# Altium schematic sheet CAN-Test-Board.SchDoc
size C
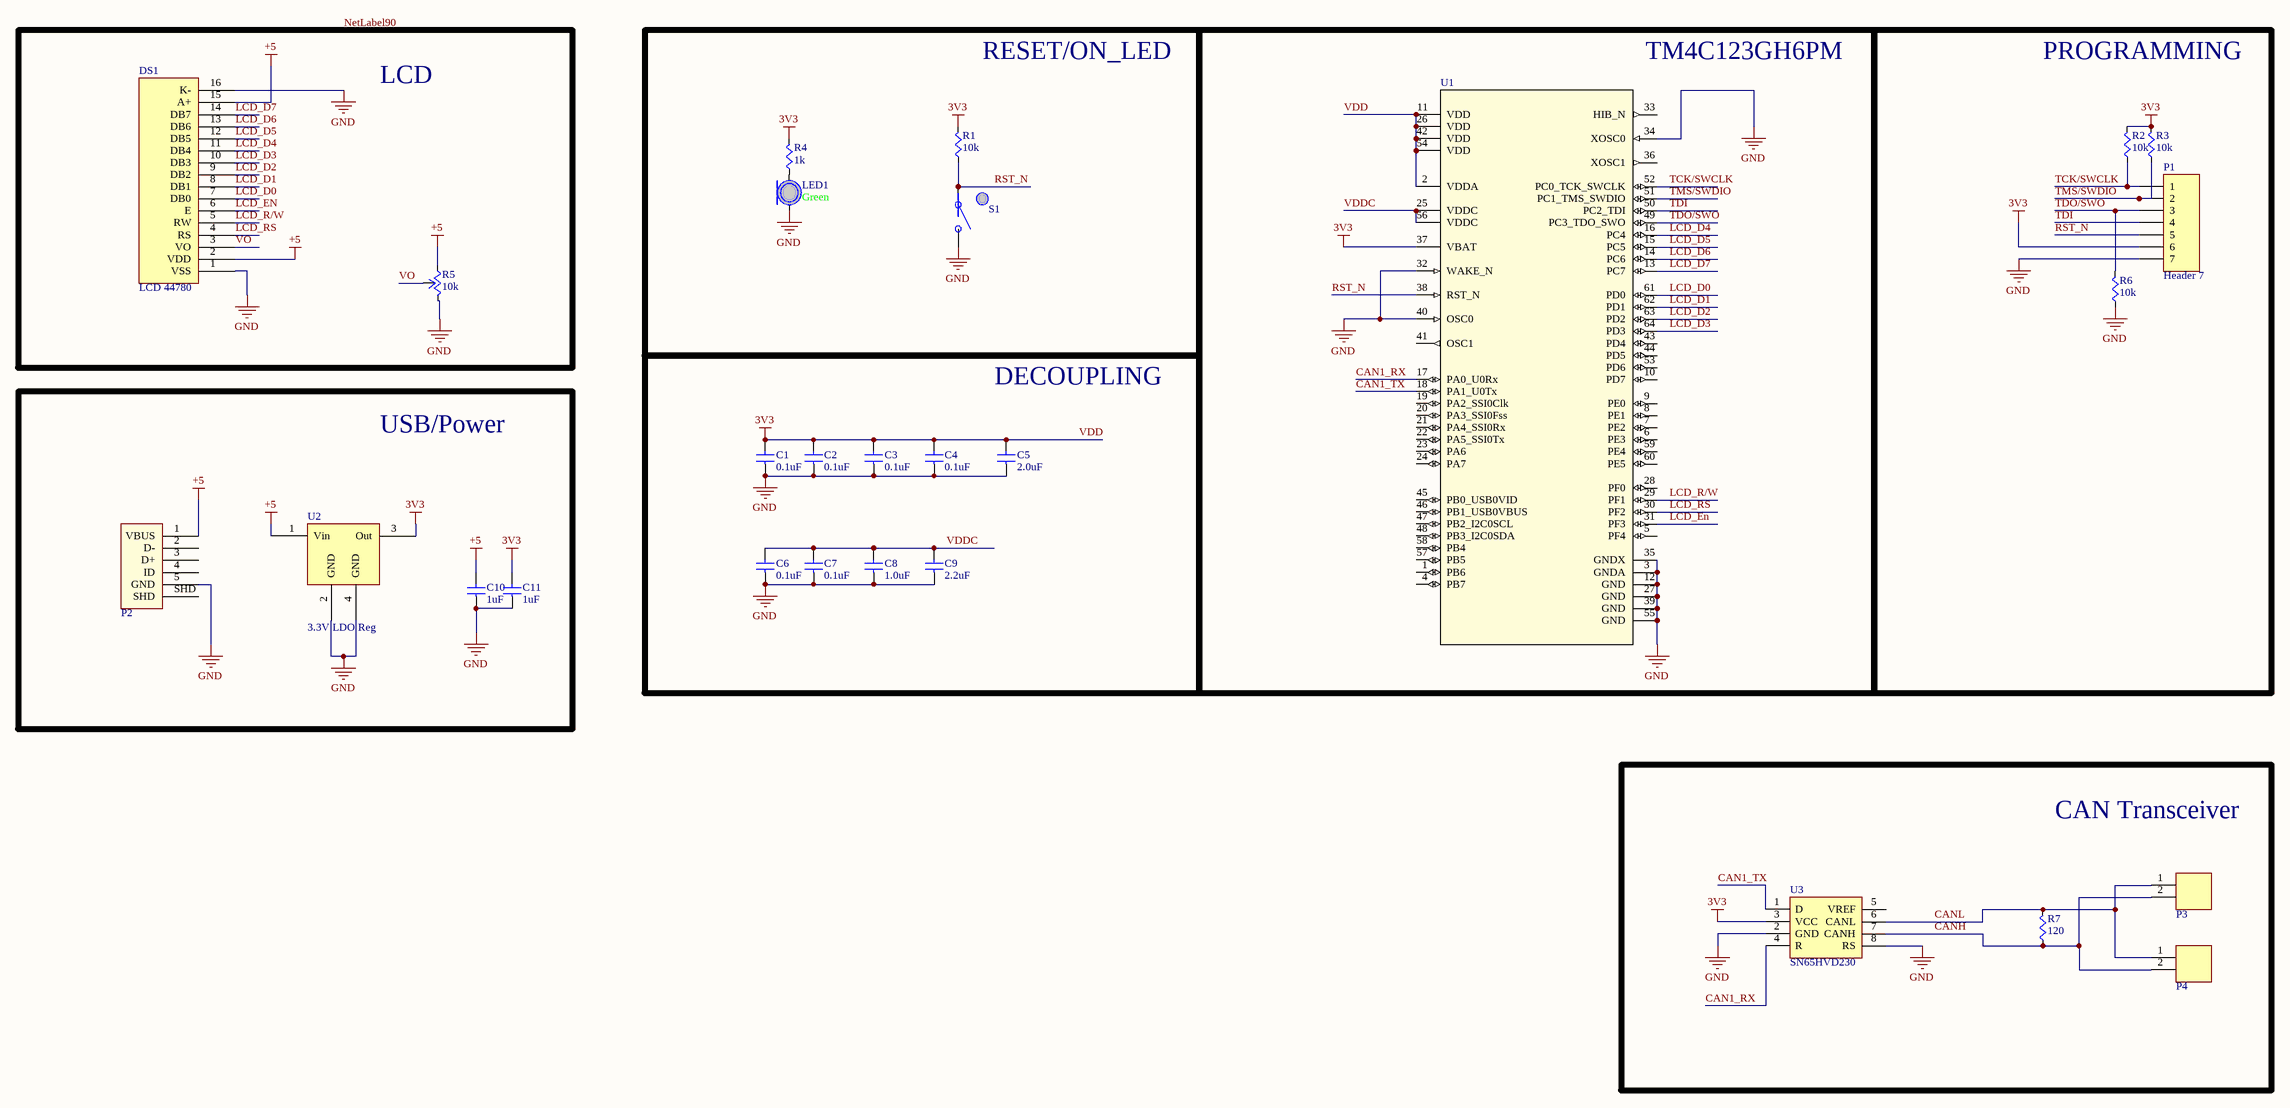
[diagram p0: CAN-Test-Board.SchDoc]

## Parts
C1  value 0.1uF  [CAPC0603]  (hidden comment: Cap)
C2  value 0.1uF  [CAPC0603]  (hidden comment: Cap)
C3  value 0.1uF  [CAPC0603]  (hidden comment: Cap)
C4  value 0.1uF  [CAPC0603]  (hidden comment: Cap)
C5  value 2.0uF  [CAPC0603]  (hidden comment: Cap)
C6  value 0.1uF  [CAPC0603]  (hidden comment: Cap)
C7  value 0.1uF  [CAPC0603]  (hidden comment: Cap)
C8  value 1.0uF  [CAPC0603]  (hidden comment: Cap)
C9  value 2.2uF  [CAPC0603]  (hidden comment: Cap)
C10  value 1uF  [CAPC0603]  (hidden comment: Cap)
C11  value 1uF  [CAPC0603]  (hidden comment: Cap)
DS1  LCD 44780  [OLED 16x2]
LED1  Color: Green  [LED0603]  (hidden comment: LED)
P1  Header 7  [HDR1X7]
P2  USB Micro  [10118192-0001LF]  (value not drawn)
P3  2-pin Horz Sherlock  [MOLEX-HDR-1X2-SHERLOCK-HORZ]  (value not drawn)
P4  2-pin Horz Sherlock  [MOLEX-HDR-1X2-SHERLOCK-HORZ]  (value not drawn)
R1  value 10k  [RES0603]  (hidden comment: Res)
R2  value 10k  [RES0603]  (hidden comment: Res)
R3  value 10k  [RES0603]  (hidden comment: Res)
R4  value 1k  [RES0603]  (hidden comment: Res)
R5  value 10k  [ST4ETA103]  (hidden comment: Pot)
R6  value 10k  [RES0603]  (hidden comment: Res)
R7  value 120  [RES0603]  (hidden comment: Res)
S1  Button  [PTS645xxxxSMTR92]  (value not drawn)
U1  (no value)  [PM0064A_N]
U2  3.3V LDO Reg  [SOT23-4n]
U3  SN65HVD230

## Blocks framed on the sheet
LCD: DS1 R5
RESET/ON_LED: LED1 R1 R4 S1
TM4C123GH6PM: U1
PROGRAMMING: P1 R2 R3 R6
USB/Power: C10 C11 P2 U2
DECOUPLING: C1-C9
CAN Transceiver: P3 P4 R7 U3

## Nets
+5: C10.1(A) DS1.2(VDD) DS1.15(A+) P2.1(VBUS) R5.2 U2.1(Vin)
GND: C1.2(B) C2.2(B) C3.2(B) C4.2(B) C5.2(B) C6.2(B) C7.2(B) C8.2(B) C9.2(B) C10.2(B) C11.2(B) DS1.1(VSS) DS1.16(K-) LED1.C P1.7 P2.5(GND) R5.1 R6.2(B) S1.B U1.3(GNDA) U1.12(GND) U1.27(GND) U1.32(WAKE_N) U1.34(XOSC0) U1.35(GNDX) U1.39(GND) U1.40(OSC0) U1.55(GND) U2.2(GND) U2.4(GND) U3.2(GND) U3.8(RS)
VDD: C1.1(A) C2.1(A) C3.1(A) C4.1(A) C5.1(A) C11.1(A) P1.6 R1.1(A) R2.1(A) R3.1(A) R4.1(A) U1.2(VDDA) U1.11(VDD) U1.26(VDD) U1.37(VBAT) U1.42(VDD) U1.54(VDD) U2.3(Out) U3.3(VCC)  [also labelled 3V3]
CAN1_RX: U1.17(PA0_U0Rx) U3.4(R)
CAN1_TX: U1.18(PA1_U0Tx) U3.1(D)
CANH: P3.2 P4.2 R7.2(B) U3.7(CANH)
CANL: P3.1 P4.1 R7.1(A) U3.6(CANL)
LCD_D0: DS1.7(DB0) U1.61(PD0)
LCD_D1: DS1.8(DB1) U1.62(PD1)
LCD_D2: DS1.9(DB2) U1.63(PD2)
LCD_D3: DS1.10(DB3) U1.64(PD3)
LCD_D4: DS1.11(DB4) U1.16(PC4)
LCD_D5: DS1.12(DB5) U1.15(PC5)
LCD_D6: DS1.13(DB6) U1.14(PC6)
LCD_D7: DS1.14(DB7) U1.13(PC7)
LCD_En: DS1.6(E) U1.31(PF3)
LCD_R/W: DS1.5(RW) U1.29(PF1)
LCD_RS: DS1.4(RS) U1.30(PF2)
RST_N: P1.5 R1.2(B) S1.A U1.38(RST_N)
TCK/SWCLK: P1.1 R2.2(B) U1.52(PC0_TCK_SWCLK)
TDI: P1.4 U1.50(PC2_TDI)
TDO/SWO: P1.3 R6.1(A) U1.49(PC3_TDO_SWO)
TMS/SWDIO: P1.2 R3.2(B) U1.51(PC1_TMS_SWDIO)
VDDC: C6.1(A) C7.1(A) C8.1(A) C9.1(A) U1.25(VDDC) U1.56(VDDC)
VO: DS1.3(VO) R5.3
NetLED1_A: LED1.A R4.2(B)

Not connected (* = marked no-connect by the designer): P2 2(D-) 3(D+) 4(ID) SHD; U1 1(PB6) 4(PB7) 5(PF4) 6(PE3) 7(PE2) 8(PE1) 9(PE0) 10(PD7) 19(PA2_SSI0Clk) 20(PA3_SSI0Fss) 21(PA4_SSI0Rx) 22(PA5_SSI0Tx) 23(PA6) 24(PA7) 28(PF0) 33(HIB_N) 36(XOSC1) 41(OSC1) 43(PD4) 44(PD5) 45(PB0_USB0VID) 46(PB1_USB0VBUS) 47(PB2_I2C0SCL) 48(PB3_I2C0SDA) 53(PD6) 57(PB5) 58(PB4) 59(PE4) 60(PE5); U3 5(VREF)

## Notes on the sheet
- Labels drawn without touching a wire or pin: NetLabel90

## Library data of the parts
P1 = Header 7: Header, 7-Pin; LatestRevisionDate: 17-Jul-2002; LatestRevisionNote: Re-released for DXP Platform.; Publisher: Altium Limited
P2 = USB Micro: USB Mini B Metal Shield SMT; Supplier 1: Digi-Key; Supplier Part Number 1: 609-4613-1-ND
P3 P4 = MOLEX-HDR-1x2-SHERLOCK_RA: Header, Molex, 2mm Pitch Sherlock Header, Single Row, Horizontal, 2 Circuits, Length 3.3mm,  0353630260; Manufacturer: Molex Inc; Manufacturer Part Number: 0353630260; Supplier Part Number 1: WM18931-ND; Supplier 1: Digi-Key
R5 = Potentiometer: Supplier 1: Digi-Key; Supplier Part Number 1: ST4ETA103CT-ND
S1 = Button: SPST Button; Supplier 1: Digi-Key; Supplier Part Number 1: CKN9087CT-ND
U1 = TM4C123GH6PMT7R: Imported; PartNumber: TM4C123GH6PMTR; Manufacturer: Texas Instruments; CompType: IC; PIN_COUNT: 64; Application_BuildNumber: *; Alternate_PartNumber: TM4C123GH6PMT; PackageReference: PM0064A; MountType: SMT; RoHS: Y; RefDes: RefDes; TYPE: TYPE; Value: Value
U2 = TLV1117LV: IC REG LDO 3.3V 1A SOT223; Supplier 1: Digi-Key; Supplier Part Number 1: LM3940IMPX-3.3/NOPBCT-ND
U3 = SN65HVD230: 3.3V CAN Bus Transceiver
C1-C11 = Cap: Supplier 1: Digi-Key; Supplier Part Number 1: 1276-1000-1-ND
LED1 = LED: Supplier 1: Digi-Key; Supplier Part Number 1: 754-1122-1-ND
R1-R4 R6 R7 = Res: Supplier 1: Digi-Key; Supplier Part Number 1: RMCF0603JT10K0CT-ND